# Altium project esc.PrjPCB
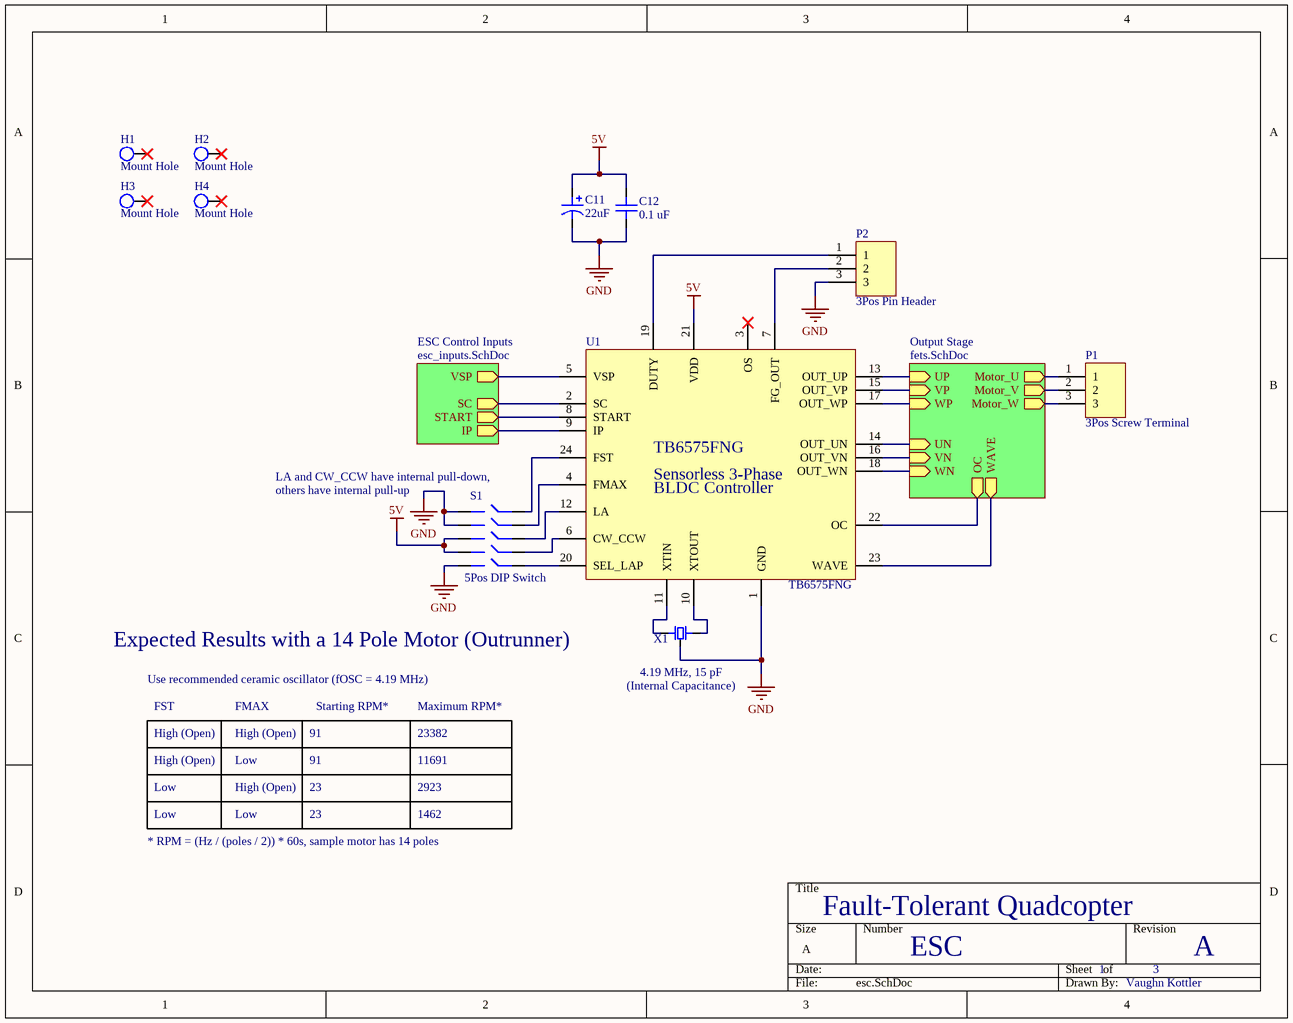
[diagram p0: esc.SchDoc]
3 sheets, 64 parts. Net scope: hierarchical (ports join the sheet entries above them; power ports are global).
Board file: esc.PcbDoc
Sheets:
  esc.SchDoc
    Output Stage = fets.SchDoc
    ESC Control Inputs = esc_inputs.SchDoc

## Sheet esc.SchDoc: Fault-Tolerant Quadcopter
size A; DrawnBy: Vaughn Kottler; Engineer: Vaughn Kottler; Revision: A

### Parts
C11  22uF  [CAP-CAN-5.3x5.3]
C12  0.1 uF  [CAP-CER-0805-SHORT]
H1  Mount Hole  [m2 Mount Hole]
H2  Mount Hole  [m2 Mount Hole]
H3  Mount Hole  [m2 Mount Hole]
H4  Mount Hole  [m2 Mount Hole]
P1  3Pos Screw Terminal  [3Pos Screw Terminal]
P2  3Pos Pin Header  [3Pos Pin Header F RA R]
S1  5Pos DIP Switch  [DIP-SW-5]
U1  TB6575FNG  [SSOP24-0.65]
X1  4.19 MHz, 15 pF  [CSTCR]

### Sub-sheets
ESC Control Inputs = esc_inputs.SchDoc: IP (out), START (out), SC (out), VSP (out)
Output Stage = fets.SchDoc: UN (in), WN (in), VN (in), Motor_W (out), Motor_U (out), WAVE (out), OC (out), Motor_V (out), WP (in), UP (in), VP (in)

### Nets
5V: C11.1 C12.2 S1.3 S1.4 U1.21(VDD)
GND: C11.2 C12.1 P2.3 S1.1 S1.2 S1.5 U1.1(GND) X1.2(GND)
IP: U1.9(IP) ; sheet ESC Control Inputs/IP
Motor_U: P1.1 ; sheet Output Stage/Motor_U
Motor_V: P1.2 ; sheet Output Stage/Motor_V
Motor_W: P1.3 ; sheet Output Stage/Motor_W
OC: U1.22(OC) ; sheet Output Stage/OC
SC: U1.2(SC) ; sheet ESC Control Inputs/SC
START: U1.8(START) ; sheet ESC Control Inputs/START
UN: U1.14(OUT_UN) ; sheet Output Stage/UN
UP: U1.13(OUT_UP) ; sheet Output Stage/UP
VN: U1.16(OUT_VN) ; sheet Output Stage/VN
VP: U1.15(OUT_VP) ; sheet Output Stage/VP
WAVE: U1.23(WAVE) ; sheet Output Stage/WAVE
WN: U1.18(OUT_WN) ; sheet Output Stage/WN
WP: U1.17(OUT_WP) ; sheet Output Stage/WP
NetP2_1: P2.1 U1.19(DUTY)
NetP2_2: P2.2 U1.7(FG_OUT)
NetR16_2: U1.5(VSP) ; sheet ESC Control Inputs/VSP
NetS1_6: S1.6 U1.20(SEL_LAP)
NetS1_7: S1.7 U1.6(CW_CCW)
NetS1_8: S1.8 U1.12(LA)
NetS1_9: S1.9 U1.4(FMAX)
NetS1_10: S1.10 U1.24(FST)
NetU1_10: U1.10(XTOUT) X1.3(OUT)
NetU1_11: U1.11(XTIN) X1.1(IN)

Not connected (* = marked no-connect by the designer): H1 H*; H2 H*; H3 H*; H4 H*; U1 3(OS)*

### Notes on the sheet
- (near S1) LA and CW_CCW have internal pull-down,
- (near S1) others have internal pull-up
- (near X1) Expected Results with a 14 Pole Motor (Outrunner)
- Use recommended ceramic oscillator (fOSC = 4.19 MHz)
- (near X1) (Internal Capacitance)
- FST
- High (Open)
- FMAX
- Low
- 91
- Starting RPM*
- Maximum RPM*
- 11691
- 23382
- 23
- 1462
- 2923
- * RPM = (Hz / (poles / 2)) * 60s, sample motor has 14 poles
- ESC
- 1
- 3
- (in symbol TB6575FNG) Sensorless 3-Phase; BLDC Controller

### Library data of the parts
C11 = CAP-CAN-22uF-35V: ±20%, 5.3mm x 5.3mm; Supplier 1: Digi-Key; Supplier Part Number 1: PCE3838DKR-ND
C12 = CAP-CER-0.1uF-25V: 10%, 0805; ComponentLink1Description: Capacitor Book (Amazon); ComponentLink1URL: https://www.amazon.com/gp/product/B0728HBDRW/
P1 = 3Pos Screw Terminal: 0.2" Pitch 1x3
P2 = 3Pos Pin Header: 0.1" Pitch 1x3
S1 = 5Pos DIP Switch: 5 Position 0.1" SMT Dip Switch; Supplier 1: Digi-Key; Supplier Part Number 1: CT2195LPST-ND
U1 = TB6575FNG: Sensorless 3-Phase BLDC Controller; Supplier 1: Digi-Key; Supplier Part Number 1: TB6575FNGC8ELDKR-ND; ComponentLink1Description: Datasheet; ComponentLink1URL: toshiba.semicon-storage.com/info/docget.jsp?did=2162&prodName=TB6575FNG
X1 = XTAL-4.19MHz-15pF: Ceramic, 3-SMD, Built-In Capacitance; Supplier 1: Digi-Key; ComponentLink1Description: Part Numbering; ComponentLink1URL: https://www.murata.com/en-us/products/productdata/8796821913630/L0430E.pdf; ComponentLink2Description: Application Note; ComponentLink2URL: https://www.murata.com/~/media/webrenewal/support/library/catalog/products/timingdevice/ceralock/p17e.ashx; ComponentLink3Description: Datasheet; ComponentLink3URL: https://www.murata.com/~/media/webrenewal/support/library/catalog/products/timingdevice/ceralock/p16e.ashx; Supplier Part Number 1: 490-1201-6-ND

## Sheet fets.SchDoc: Fault-Tolerant Quadcopter
size A; DrawnBy: Vaughn Kottler; Engineer: Vaughn Kottler; Revision: A
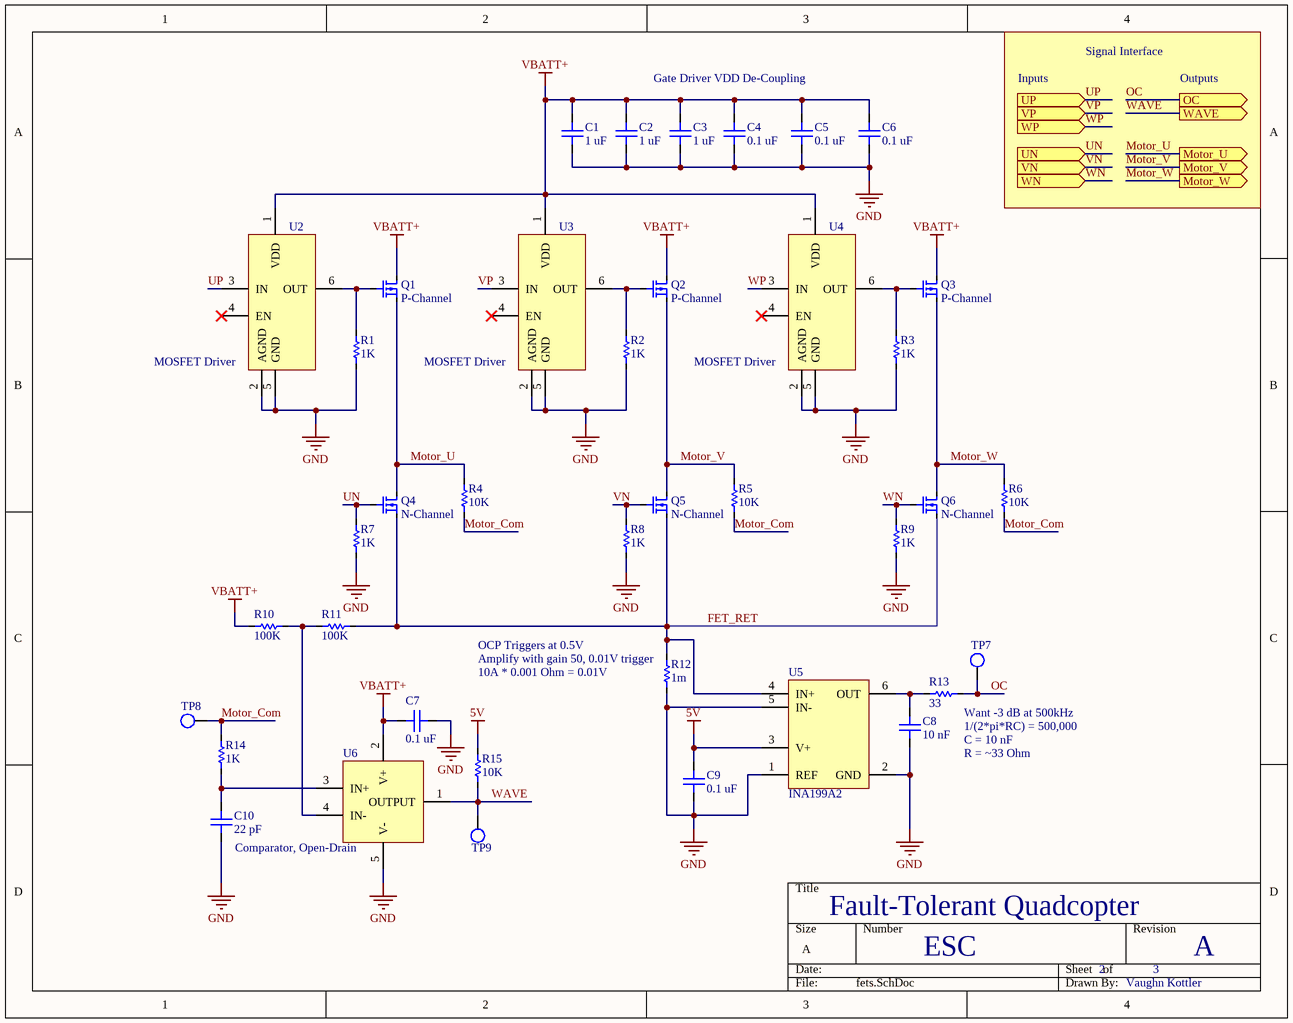
[diagram p1: fets.SchDoc]

### Parts
C1  1 uF  [CAP-CER-0805-TALL]
C2  1 uF  [CAP-CER-0805-TALL]
C3  1 uF  [CAP-CER-0805-TALL]
C4  0.1 uF  [CAP-CER-0805-SHORT]
C5  0.1 uF  [CAP-CER-0805-SHORT]
C6  0.1 uF  [CAP-CER-0805-SHORT]
C7  0.1 uF  [CAP-CER-0805-SHORT]
C8  10 nF  [CAP-CER-0805-SHORT]
C9  0.1 uF  [CAP-CER-0805-SHORT]
C10  22 pF  [CAP-CER-0805-SHORT]
Q1  P-Channel  [DPAK]
Q2  P-Channel  [DPAK]
Q3  P-Channel  [DPAK]
Q4  N-Channel  [DPAK]
Q5  N-Channel  [DPAK]
Q6  N-Channel  [DPAK]
R1  1K  [RES-0805]
R2  1K  [RES-0805]
R3  1K  [RES-0805]
R4  10K  [RES-0805]
R5  10K  [RES-0805]
R6  10K  [RES-0805]
R7  1K  [RES-0805]
R8  1K  [RES-0805]
R9  1K  [RES-0805]
R10  100K  [RES-0805]
R11  100K  [RES-0805]
R12  1m  [RES-1206]
R13  33  [RES-0805]
R14  1K  [RES-0805]
R15  10K  [RES-0805]
TP7  Test Point  [0603 Test Point]  (value not drawn)
TP8  Test Point  [0603 Test Point]  (value not drawn)
TP9  Test Point  [0603 Test Point]  (value not drawn)
U2  MOSFET Driver  [SOT-23-6]
U3  MOSFET Driver  [SOT-23-6]
U4  MOSFET Driver  [SOT-23-6]
U5  INA199A2  [SC70]
U6  Comparator, Open-Drain  [SOT-23-5]

### Ports
Motor_U (out), Motor_V (out), Motor_W (out), OC (out), UN (in), UP (in), VN (in), VP (in), WAVE (out), WN (in), WP (in)

### Nets
5V: C9.2 R15.2 U5.3(V+)
GND: C1.1 C2.1 C3.1 C4.1 C5.1 C6.1 C7.1 C8.1 C9.1 C10.1 R1.1 R2.1 R3.1 R7.1 R8.1 R9.1 R12.2 U2.2(AGND) U2.5(GND) U3.2(AGND) U3.5(GND) U4.2(AGND) U4.5(GND) U5.1(REF) U5.2(GND) U5.5(IN-) U6.5(V-)
VBATT+: C1.2 C2.2 C3.2 C4.2 C5.2 C6.2 C7.2 Q1.2(D) Q2.2(D) Q3.2(D) R10.1 U2.1(VDD) U3.1(VDD) U4.1(VDD) U6.2(V+)
FET_RET: Q4.3(S) Q5.3(S) Q6.3(S) R11.2 R12.1 U5.4(IN+)
Motor_Com: R4.1 R5.1 R6.1 R14.2 TP8.1
Motor_U: Q1.3(S) Q4.2(D) R4.2 ; port Motor_U
Motor_V: Q2.3(S) Q5.2(D) R5.2 ; port Motor_V
Motor_W: Q3.3(S) Q6.2(D) R6.2 ; port Motor_W
OC: R13.2 TP7.1 ; port OC
UN: Q4.1(G) R7.2 ; port UN
UP: U2.3(IN) ; port UP
VN: Q5.1(G) R8.2 ; port VN
VP: U3.3(IN) ; port VP
WAVE: R15.1 TP9.1 U6.1(OUTPUT) ; port WAVE
WN: Q6.1(G) R9.2 ; port WN
WP: U4.3(IN) ; port WP
NetC8_2: C8.2 R13.1 U5.6(OUT)
NetC10_2: C10.2 R14.1 U6.3(IN+)
NetQ1_1: Q1.1(G) R1.2 U2.6(OUT)
NetQ2_1: Q2.1(G) R2.2 U3.6(OUT)
NetQ3_1: Q3.1(G) R3.2 U4.6(OUT)
NetR10_2: R10.2 R11.1 U6.4(IN-)

Not connected (* = marked no-connect by the designer): U2 4(EN)*; U3 4(EN)*; U4 4(EN)*

### Notes on the sheet
- Gate Driver VDD De-Coupling
- Inputs
- Signal Interface
- Outputs
- OCP Triggers at 0.5V
- (near R12) Amplify with gain 50, 0.01V trigger
- 10A * 0.001 Ohm = 0.01V
- (near R13) Want -3 dB at 500kHz
- (near R13) 1/(2*pi*RC) = 500,000
- C = 10 nF
- R = ~33 Ohm
- ESC
- 2
- 3

### Library data of the parts
C1-C3 = CAP-CER-1uF-10V: 10%, 0805; ComponentLink1Description: Capacitor Book (Amazon); ComponentLink1URL: https://www.amazon.com/gp/product/B0728HBDRW/
C4-C7 C9 = CAP-CER-0.1uF-25V: 10%, 0805; ComponentLink1Description: Capacitor Book (Amazon); ComponentLink1URL: https://www.amazon.com/gp/product/B0728HBDRW/
C8 = CAP-CER-10nF-50V: 10%, 0805; ComponentLink1Description: Capacitor Book (Amazon); ComponentLink1URL: https://www.amazon.com/gp/product/B0728HBDRW/
C10 = CAP-CER-22pF-50V: ±5%, 0805; ComponentLink1Description: Capacitor Book (Amazon); ComponentLink1URL: https://www.amazon.com/gp/product/B0728HBDRW/
Q1-Q3 = PMOS-1.9VT-40VDS-40A: P-Channel MOSFET; Supplier 1: Digi-Key; Supplier Part Number 1: 785-1351-6-ND; ComponentLink1Description: Datasheet; ComponentLink1URL: http://aosmd.com/res/data_sheets/AOD4189.pdf
Q4-Q6 = NMOS-2.5VT-60VDS-35A: N-Channel MOSFET; Supplier 1: Digi-Key; Supplier Part Number 1: 497-7965-6-ND; ComponentLink1Description: Datasheet; ComponentLink1URL: https://www.st.com/content/ccc/resource/technical/document/datasheet/48/eb/5d/41/e2/c9/48/f2/CD00002363.pdf/files/CD00002363.pdf/jcr:content/translations/en.CD00002363.pdf
R1-R3 R7-R9 R14 = RES-1K-1/8W: 0805; ComponentLink1Description: Resistor Book (Amazon); ComponentLink1URL: https://www.amazon.com/gp/product/B071J21FYF/
R4-R6 R15 = RES-10K-1/8W: 0805; ComponentLink1Description: Resistor Book (Amazon); ComponentLink1URL: https://www.amazon.com/gp/product/B071J21FYF/
R10 R11 = RES-100K-1/8W: 0805; ComponentLink1Description: Resistor Book (Amazon); ComponentLink1URL: https://www.amazon.com/gp/product/B071J21FYF/
R12 = RES-1m-1W: 0805; Supplier 1: Digi-Key; Supplier Part Number 1: 696-1369-6-ND
R13 = RES-33-1/8W: 0805; ComponentLink1Description: Resistor Book (Amazon); ComponentLink1URL: https://www.amazon.com/gp/product/B071J21FYF/
TP7-TP9 = Test Point: 0603; Supplier 1: Digi-Key; Supplier Part Number 1: A106145DKR-ND
U2-U4 = MCP14A0052: 0.5A MOSFET Driver; Supplier 1: Digi-Key; Supplier Part Number 1: MCP14A0052T-E/CHDKR-ND; ComponentLink1Description: Datasheet; ComponentLink1URL: http://ww1.microchip.com/downloads/en/DeviceDoc/20005369A.pdf
U5 = INA199A2: 50 V/V, Current-Shunt Monitor; ComponentLink1Description: Datasheet; ComponentLink1URL: http://www.ti.com/lit/ds/symlink/ina199.pdf; Supplier 1: Digi-Key; Supplier Part Number 1: 296-27329-6-ND
U6 = LMC7221: Supplier 1: Digi-Key; ComponentLink1Description: Datasheet; ComponentLink1URL: http://www.ti.com/lit/ds/symlink/lmc7221.pdf; Supplier Part Number 1: LMC7221BIM5X/NOPBDKR-ND

## Sheet esc_inputs.SchDoc: Fault-Tolerant Quadcopter
size A; DrawnBy: Vaughn Kottler; Engineer: Vaughn Kottler; Revision: A
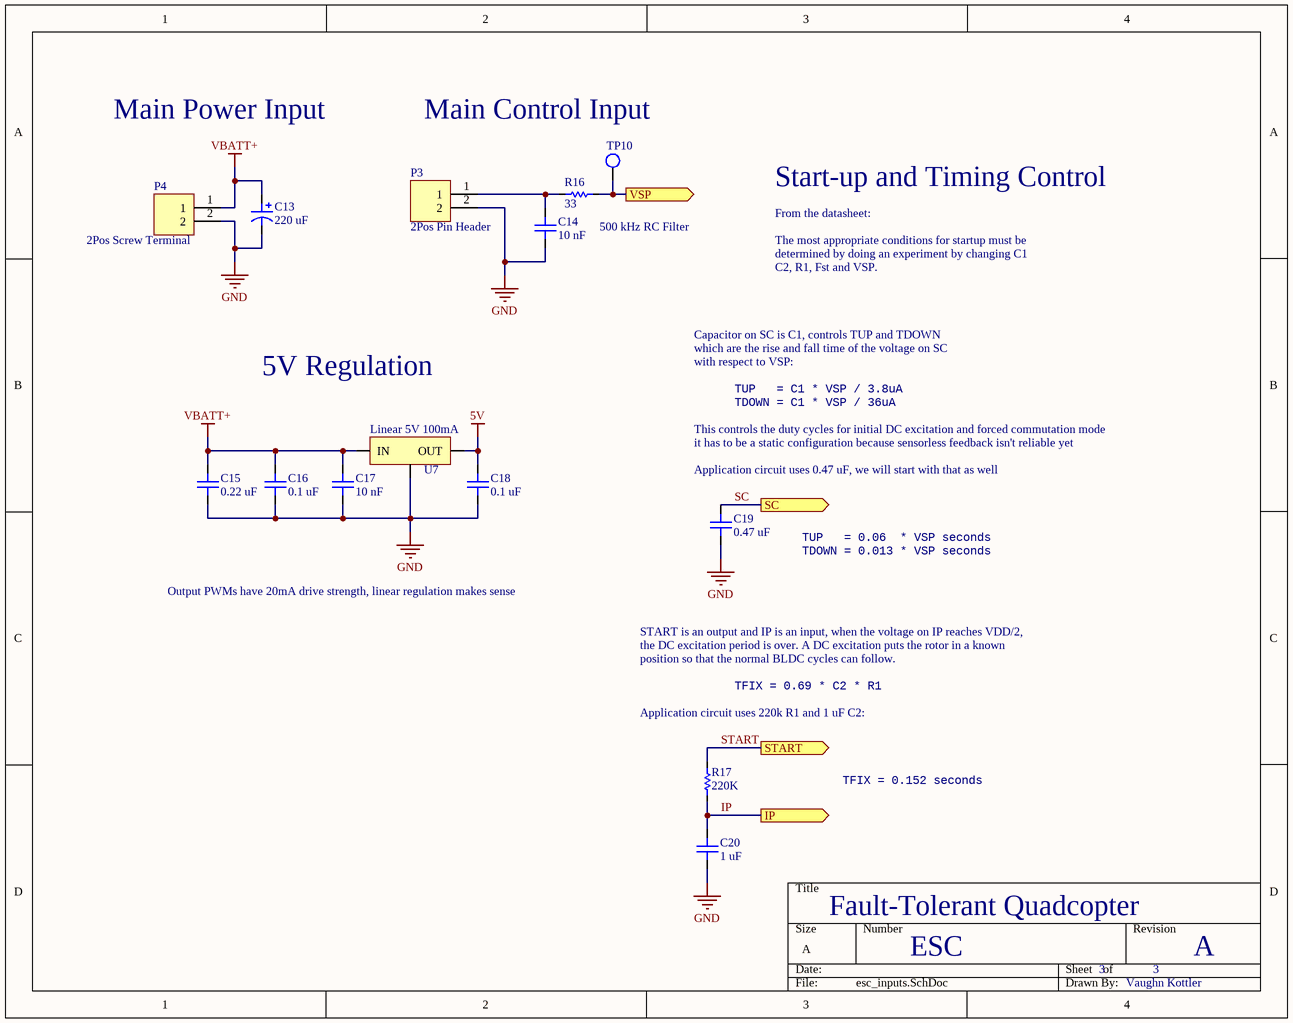
[diagram p2: esc_inputs.SchDoc]

### Parts
C13  220 uF  [CAP-CAN-8.3x8.3]
C14  10 nF  [CAP-CER-0805-SHORT]
C15  0.22 uF  [CAP-CER-0805-SHORT]
C16  0.1 uF  [CAP-CER-0805-SHORT]
C17  10 nF  [CAP-CER-0805-SHORT]
C18  0.1 uF  [CAP-CER-0805-SHORT]
C19  0.47 uF  [CAP-CER-0805-TALL]
C20  1 uF  [CAP-CER-0805-TALL]
P3  2Pos Pin Header  [2Pos Pin Header F RA R]
P4  2Pos Screw Terminal  [2Pos Screw Terminal]
R16  33  [RES-0805]
R17  220K  [RES-0805]
TP10  Test Point  [0603 Test Point]  (value not drawn)
U7  Linear 5V 100mA  [SOT-89]

### Ports
IP (out), SC (out), START (out), VSP (out)

### Nets
5V: C18.2 U7.1(OUT)
GND: C13.2 C14.1 C15.1 C16.1 C17.1 C18.1 C19.1 C20.1 P3.2 P4.2 U7.2(GND)
VBATT+: C13.1 C15.2 C16.2 C17.2 P4.1 U7.3(IN)
IP: C20.2 R17.1 ; port IP
SC: C19.2 ; port SC
START: R17.2 ; port START
NetC14_2: C14.2 P3.1 R16.1
NetR16_2: R16.2 TP10.1 ; port VSP

### Notes on the sheet
- Main Power Input
- (near TP10) Main Control Input
- (near R16) 500 kHz RC Filter
- From the datasheet:
- Start-up and Timing Control
- The most appropriate conditions for startup must be
- determined by doing an experiment by changing C1
- C2, R1, Fst and VSP.
- Capacitor on SC is C1, controls TUP and TDOWN
- which are the rise and fall time of the voltage on SC
- with respect to VSP:
- 5V Regulation
- This controls the duty cycles for initial DC excitation and forced commutation mode
- TUP   = C1 * VSP / 3.8uA
- TDOWN = C1 * VSP / 36uA
- (near C19) Application circuit uses 0.47 uF, we will start with that as well
- it has to be a static configuration because sensorless feedback isn't reliable yet
- TUP   = 0.06  * VSP seconds
- TDOWN = 0.013 * VSP seconds
- Output PWMs have 20mA drive strength, linear regulation makes sense
- START is an output and IP is an input, when the voltage on IP reaches VDD/2,
- the DC excitation period is over. A DC excitation puts the rotor in a known
- position so that the normal BLDC cycles can follow.
- TFIX = 0.69 * C2 * R1
- (near R17) Application circuit uses 220k R1 and 1 uF C2:
- TFIX = 0.152 seconds
- ESC
- 3

### Library data of the parts
C13 = CAP-CAN-220uF-35V: ±20%, 8.3mm x 8.3mm; Supplier 1: Digi-Key; Supplier Part Number 1: PCE3955DKR-ND
C14 = CAP-CER-10nF-50V: 10%, 0805; ComponentLink1Description: Capacitor Book (Amazon); ComponentLink1URL: https://www.amazon.com/gp/product/B0728HBDRW/
C15 = CAP-CER-0.22uF-50V: 10%, 0805; ComponentLink1Description: Capacitor Book (Amazon); ComponentLink1URL: https://www.amazon.com/gp/product/B0728HBDRW/
C16 C18 = CAP-CER-0.1uF-25V: 10%, 0805; ComponentLink1Description: Capacitor Book (Amazon); ComponentLink1URL: https://www.amazon.com/gp/product/B0728HBDRW/
C17 = CAP-CER-10nF-50V: ±10%, 0805; ComponentLink1Description: Capacitor Book (Amazon); ComponentLink1URL: https://www.amazon.com/gp/product/B0728HBDRW/
C19 = CAP-CER-0.47uF-50V: ±10%, 0805; ComponentLink1Description: Capacitor Book (Amazon); ComponentLink1URL: https://www.amazon.com/gp/product/B0728HBDRW/
C20 = CAP-CER-1uF-10V: ±10%, 0805; ComponentLink1Description: Capacitor Book (Amazon); ComponentLink1URL: https://www.amazon.com/gp/product/B0728HBDRW/
P3 = 2Pos Pin Header: 0.1" Pitch 1x2
P4 = 2Pos Screw Terminal: 0.2" Pitch 1x2
R16 = RES-33-1/8W: 0805; ComponentLink1Description: Resistor Book (Amazon); ComponentLink1URL: https://www.amazon.com/gp/product/B071J21FYF/
R17 = RES-220K-1/8W: 0805; ComponentLink1Description: Resistor Book (Amazon); ComponentLink1URL: https://www.amazon.com/gp/product/B071J21FYF/
TP10 = Test Point: 0603; Supplier 1: Digi-Key; Supplier Part Number 1: A106145DKR-ND
U7 = L78L05ACUTR: Linear Regulator, 5V, 100mA; Supplier 1: Digi-Key; ComponentLink1Description: Datasheet; ComponentLink1URL: https://www.st.com/content/ccc/resource/technical/document/datasheet/15/55/e5/aa/23/5b/43/fd/CD00000446.pdf/files/CD00000446.pdf/jcr:content/translations/en.CD00000446.pdf; Supplier Part Number 1: 497-1183-6-ND

## Nets that join several sheets
5V: esc (5 pins), fets (C9.2 R15.2 U5.3), esc_inputs (C18.2 U7.1)
GND: esc (8 pins), fets (27 pins), esc_inputs (11 pins)
VBATT+: fets (15 pins), esc_inputs (6 pins)
IP: esc (U1.9), esc_inputs (C20.2 R17.1)
Motor_U: esc (P1.1), fets (Q1.3 Q4.2 R4.2)
Motor_V: esc (P1.2), fets (Q2.3 Q5.2 R5.2)
Motor_W: esc (P1.3), fets (Q3.3 Q6.2 R6.2)
NetR16_2: esc (U1.5), esc_inputs (R16.2 TP10.1)
OC: esc (U1.22), fets (R13.2 TP7.1)
SC: esc (U1.2), esc_inputs (C19.2)
START: esc (U1.8), esc_inputs (R17.2)
UN: esc (U1.14), fets (Q4.1 R7.2)
UP: esc (U1.13), fets (U2.3)
VN: esc (U1.16), fets (Q5.1 R8.2)
VP: esc (U1.15), fets (U3.3)
WAVE: esc (U1.23), fets (R15.1 TP9.1 U6.1)
WN: esc (U1.18), fets (Q6.1 R9.2)
WP: esc (U1.17), fets (U4.3)